# EAGLE schematic caldi (EAGLE 6.4)
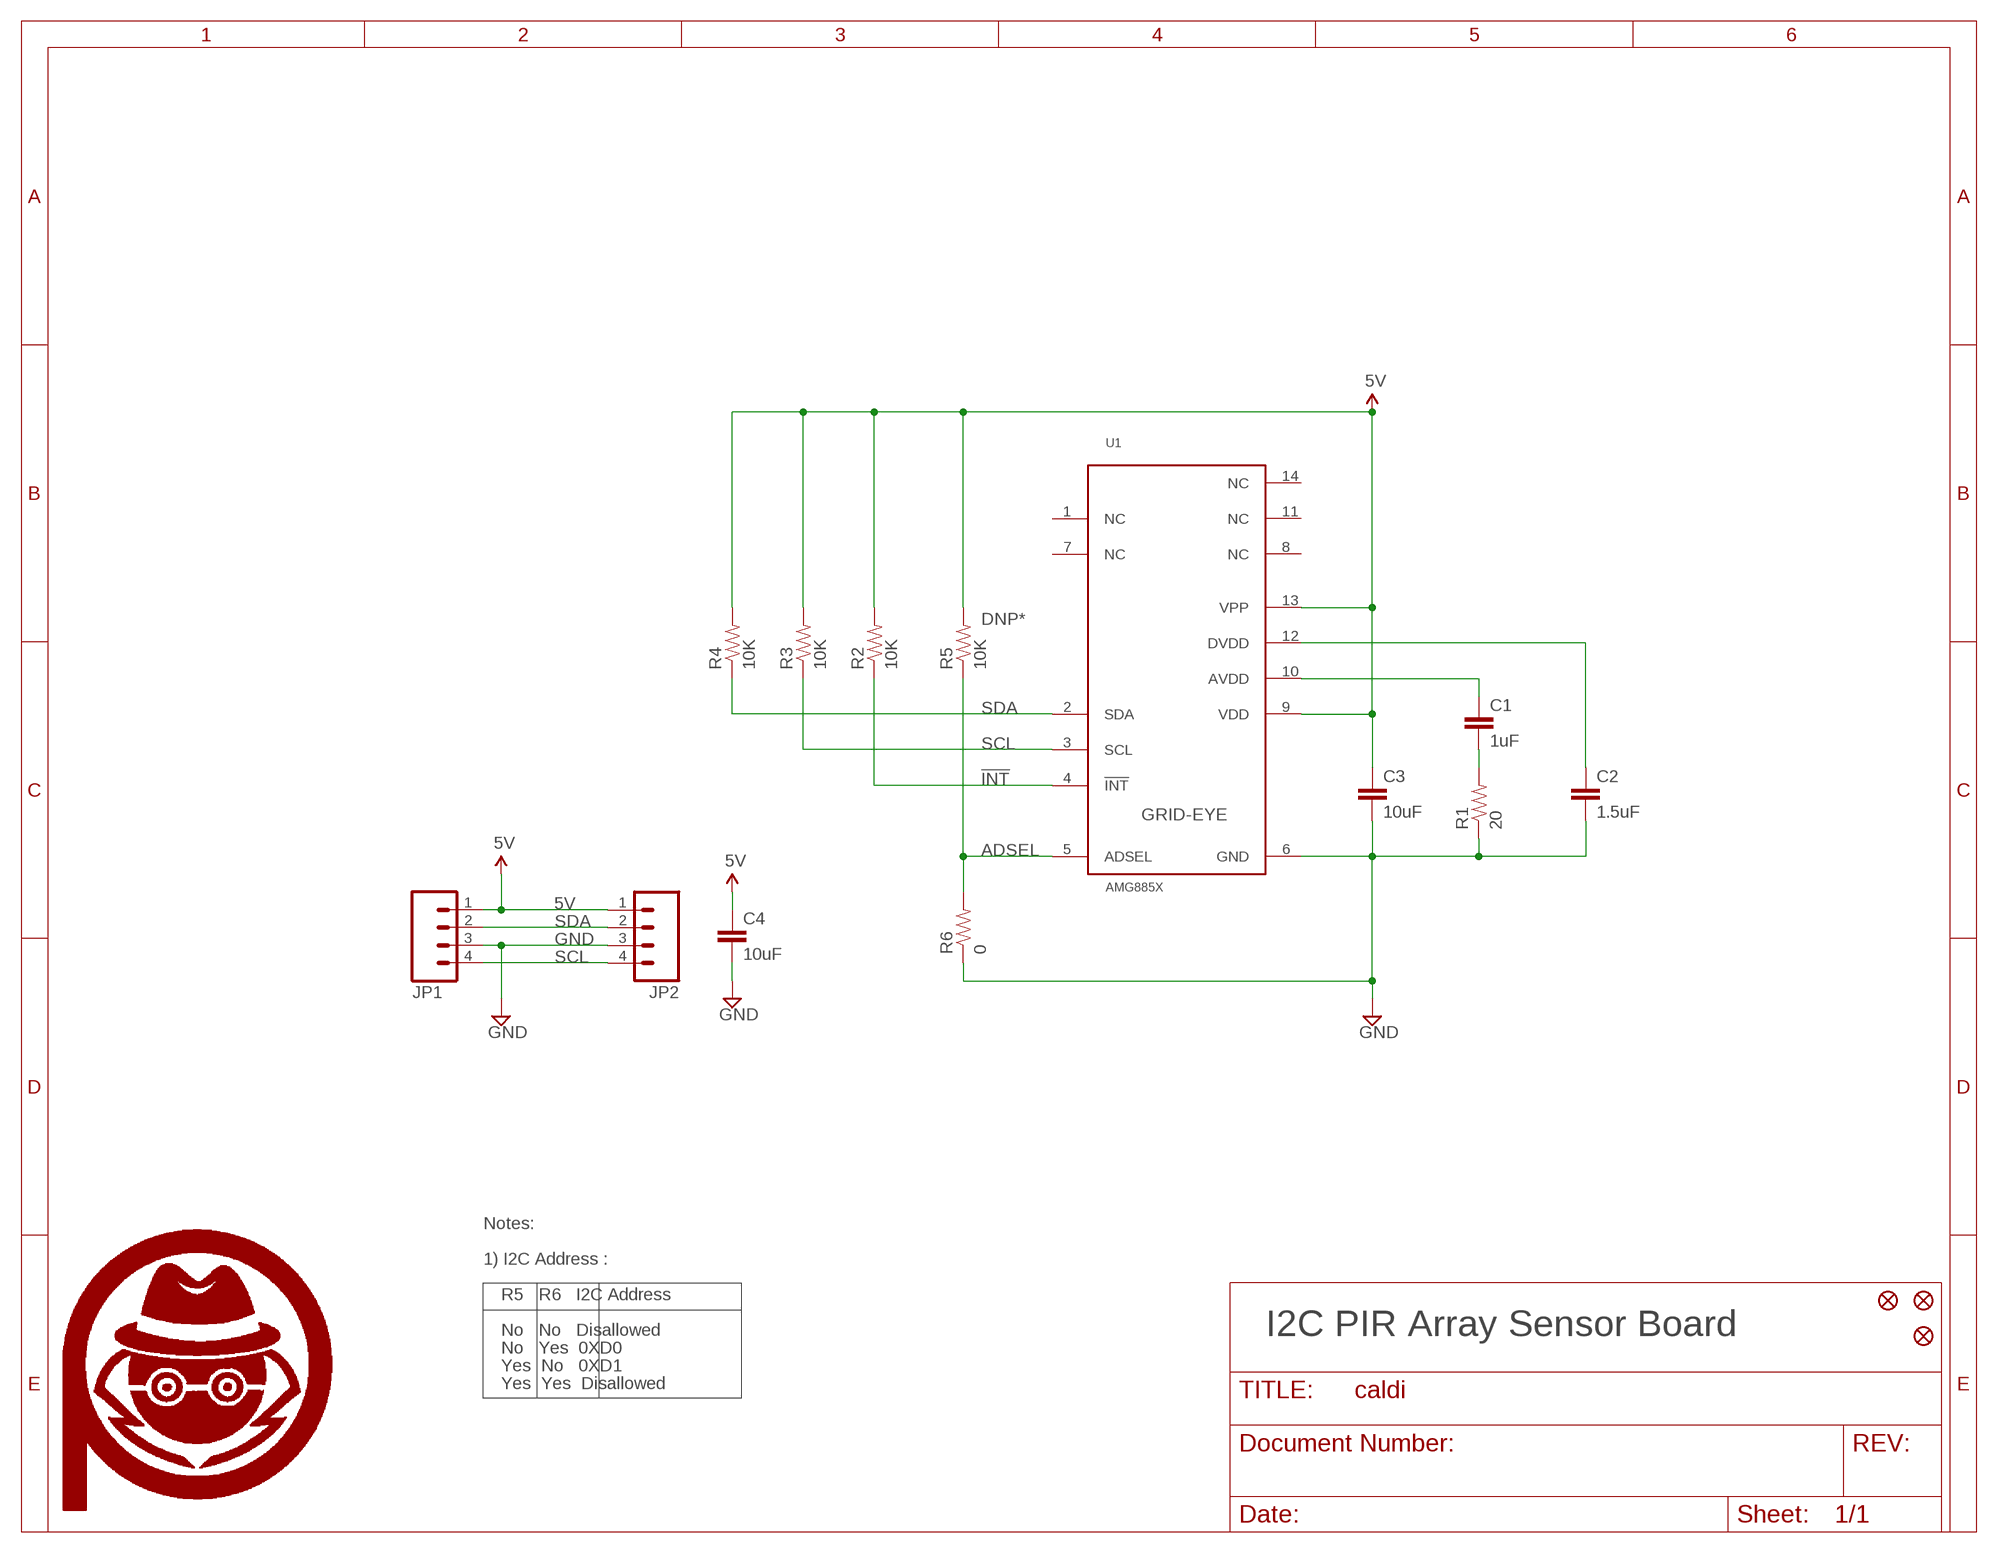
[diagram p0: schematic, sheet 1]

## Parts
C1  1uF  CAP0603-CAP  [0603-CAP]
C2  1.5uF  CAP0603-CAP  [0603-CAP]
C3  10uF  CAP0603-CAP  [0603-CAP]
C4  10uF  CAP0603-CAP  [0603-CAP]
JP1  M04POLAR_LOCK  [MOLEX-1X4_LOCK]
JP2  M04POLAR_LOCK  [MOLEX-1X4_LOCK]
JP3  FIDUCIAL1X2  [FIDUCIAL-1X2]
JP4  FIDUCIAL1X2  [FIDUCIAL-1X2]
JP5  FIDUCIAL1X2  [FIDUCIAL-1X2]
R1  20  RESISTOR_SFE0603-RES  [0603-RES]
R2  10K  RESISTOR_SFE0603-RES  [0603-RES]
R3  10K  RESISTOR_SFE0603-RES  [0603-RES]
R4  10K  RESISTOR_SFE0603-RES  [0603-RES]
R5  10K  RESISTOR_SFE0603-RES  [0603-RES]
R6  0  RESISTOR_SFE0603-RES  [0603-RES]
U1  AMG885X  [AMG885X]
U$4  PA_LOGO_SYMMED  [PA_LOGO_AGENT_MED_SYM]

## Nets
5V: C3.1 C4.1 JP1.1 JP2.1 R2.2 R3.2 R4.2 R5.2 U1.9(VDD) U1.13(VPP)
!INT!: R2.1 U1.4(!INT!)
ADSEL: R5.1 R6.2 U1.5(ADSEL)
GND: C2.2 C3.2 C4.2 JP1.3 JP2.3 R1.1 R6.1 U1.6(GND)
N$7: C1.1 U1.10(AVDD)
N$8: C1.2 R1.2
N$11: C2.1 U1.12(DVDD)
SCL: JP1.4 JP2.4 R3.1 U1.3(SCL)
SDA: JP1.2 JP2.2 R4.1 U1.2(SDA)
Unconnected: U1.1(NC) U1.7(NC) U1.8(NC) U1.11(NC) U1.14(NC)

## Notes on the sheet
- DNP*
- Notes:
- 1) I2C Address :
- R5   R6   I2C Address
- No   No   Disallowed | I2C PIR Array Sensor Board
- No   Yes  0XD0
- Yes  No   0XD1
- Yes  Yes  Disallowed

## Library data of the parts
C1-C4 = moxdes_V1_0:CAP: Capacitor Standard 0603 ceramic capacitor, and 0.1" leaded capacitor.
JP1 JP2 = SparkFun:M04: Header 4 Standard 4-pin 0.1" header. Use with straight break away headers (SKU : PRT-00116), right angle break away headers (PRT-00553), swiss pins (PRT-00743), machine pins (PRT-00117), and female headers (PRT-00115). Molex polarized connector foot print use with SKU : PRT-08231 with associated crimp pins and housings. 1MM SMD Version SKU: PRT-10208
JP3-JP5 = PatternAgents-Misc:FIDUCIAL: Fiducial Alignment Points Various fiducial points for machine vision alignment.
R1-R6 = moxdes_V1_0:RESISTOR_SFE: Resistor Basic schematic elements and footprints for 0603, 1206, and PTH resistors.
U1 = moxdes_V1_0:AMG885X: Panasonic Grid-EYE IR ARRAY Sensor AMG885x
U$4 = PatternAgents-Logos:PA_LOGO_SYM: PatternAgents Logo Symbol Trademark : PatternAgents, LLC Github : https://github.com/PatternAgents/PCB_Libraries License : http://creativecommons.org/licenses/by-sa/3.0/ (Creative Commons 3.0) THIS SOFTWARE IS PROVIDED BY THE CONTRIBUTORS "AS IS" AND WITHOUT ANY EXPRESS OR IMPLIED WARRANTIES, INCLUDING, BUT NOT LIMITED TO, THE IMPLIED WARRANTIES OF MERCHANTABILITY AND FITNESS FOR A PARTICULAR PURPOSE ARE DISCLAIMED. IN NO EVENT SHALL THE COPYRIGHT OWNER OR CONTRIBUTORS BE LIABLE FOR ANY DIRECT, INDIRECT, INCIDENTAL, SPECIAL, EXEMPLARY, OR CONSEQUENTIAL DAMAGES (INCLUDING, BUT NOT LIMITED TO, PROCUREMENT OF SUBSTITUTE GOODS OR SERVICES; LOSS OF USE, DATA, OR PROFITS; OR BUSINESS INTERRUPTION) HOWEVER CAUSED AND ON ANY THEORY OF LIABILITY, WHETHER IN CONTRACT, STRICT LIABILITY, OR TORT (INCLUDING NEGLIGENCE OR OTHERWISE) ARISING IN ANY WAY OUT OF THE USE OF THIS SOFTWARE, EVEN IF ADVISED OF THE POSSIBILITY OF SUCH DAMAGE.